# EasyEDA Pro project 32位四合一电调核心板.epro, board 100V_四路_控制板
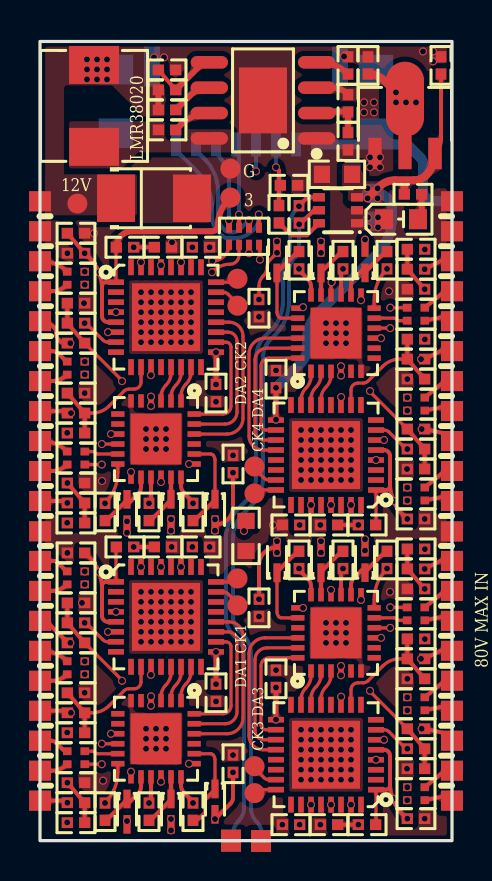
[diagram p1: board, top side]
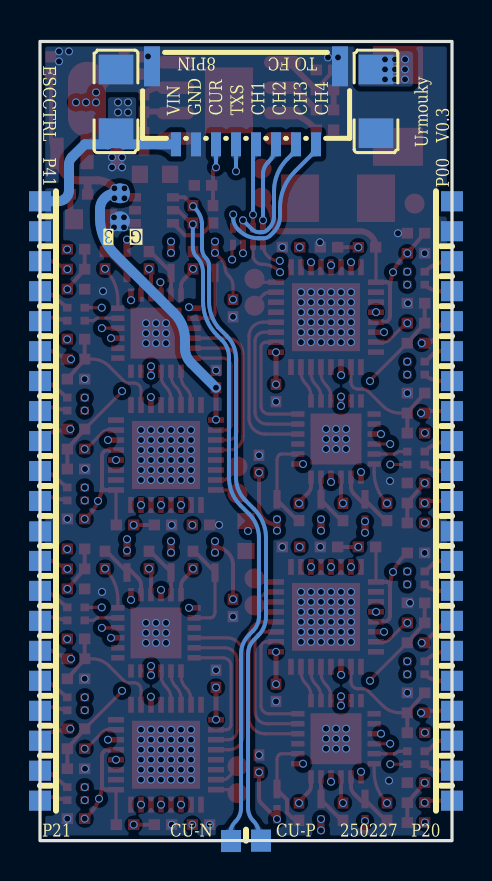
[diagram p2: board, bottom side, seen from below]

Outline 20.6 x 40 mm; copper layers: Top Layer, Inner1, Inner2, Bottom Layer. Coordinates in mm from the lower left corner of the outline.
Outline path: rectangle 0,40 20.6,0
Stack: Top Layer 0.035mm 外层铜厚1oz / Dielectric1 0.28mm 7628 RC49% 8.6mil / Inner1 0.035mm 内层铜厚 / Dielectric2 0.28mm 1.1mm H/HOZ 含铜 / Inner2 0.035mm 内层铜厚 / Dielectric3 0.28mm 7628 RC49% 8.6mil / Bottom Layer 0.035mm 外层铜厚1oz

## Design rules (mm)
template: 自定义配置
spacing copperThickness1oz (default): track to track 0.102, other pairs 0 to 0.3
spacing copperThickness2oz: track to track 0.203, other pairs 0.152 to 0.3
track width copperThickness1oz (default): min 0.127, default 0.254, max 2.54
track width copperThickness2oz: min 0.203, default 0.254, max 2.54
differential pair differentialPair (default): width min 0.127, default 0.254, max 2.54; gap min 0.152, default 0.152
via viaSize (default): diameter min 0.4, default 0.4, max 10; hole min 0.3, default 0.3, max 6.299

## Placement (name value [footprint] x y rotation side)
12V  -  [邮票孔1mm方]  0 32 0 top
C2  1nF  [R0402]  12.95 31.34 270 top
C4  100nF  [R0402]  9.65 3.85 270 top
C6  100nF  [R0402]  9.65 18.85 270 top
C7  100nF  [R0402]  20.05 38.8 90 top
C8  100nF  [R0402]  6.15 14.7 0 top
C9  100nF  [R0402]  6.15 29.7 0 top
C10  1uF  [R0402]  1.8 14.4 0 top
C11  100nF  [R0402]  8.8 7.4 90 top
C14  1uF  [R0402]  1.8 29.4 0 top
C15  100nF  [R0402]  8.8 22.4 90 top
C23  10uF  [R0603]  10.3 15.25 90 top
C24  1uF  [R0402]  16.4 38.8 270 top
C25  1uF  [R0402]  12.45 32.8 180 top
C26  1uF  [R0402]  1.8 30.4 180 top
C27  1uF  [R0402]  7.65 1.45 270 top
C28  1uF  [R0402]  5.45 1.45 270 top
C29  1uF  [R0402]  3.25 1.45 270 top
C30  1uF  [R0402]  7.65 16.45 270 top
C31  1uF  [R0402]  5.45 16.45 270 top
C32  1uF  [R0402]  3.25 16.45 270 top
C36  100nF  [R0402]  10.95 11.65 90 top
C38  100nF  [R0402]  10.95 26.65 90 top
C39  100nF  [R0402]  14.45 0.8 180 top
C40  100nF  [R0402]  14.45 15.8 180 top
C41  1uF  [R0402]  11.8 8.1 270 top
C42  100nF  [R0402]  18.8 1.1 180 top
C45  1uF  [R0402]  11.8 23.1 270 top
C46  100nF  [R0402]  18.8 16.1 180 top
C49  1uF  [R0402]  12.95 14.05 90 top
C50  1uF  [R0402]  15.15 14.05 90 top
C51  1uF  [R0402]  17.35 14.05 90 top
C52  1uF  [R0402]  12.95 29.05 90 top
C53  1uF  [R0402]  15.15 29.05 90 top
C54  1uF  [R0402]  17.35 29.05 90 top
C58  10uF  [R0603]  14.85 33.35 0 top
C61  100nF  [R0402]  6.35 35.57 0 top
C62  22uF  [C1206]  3.8 37 270 bottom
C63  4.7uF  [C1206]  16.8 37 90 bottom
C64  22uF  [CAP-SMD_L3.5-W2.8-R-RD]  5.7 32.15 180 top
CK1  -  [Test-Point-0.5mm]  9.87 13.12 0 top
CK2  -  [Test-Point-0.5mm]  9.87 28.12 0 top
CK3  -  [Test-Point-0.5mm]  10.73 2.38 180 top
CK3 DA3  -  [Test-Point-0.5mm]  10.73 3.73 180 top
CK4 DA4  -  [Test-Point-0.5mm]  10.73 17.38 180 top
CK5  -  [Test-Point-0.5mm]  1.87 31.88 0 top
CK6  -  [Test-Point-0.5mm]  9.52 32.18 0 top
CK7  -  [Test-Point-0.5mm]  9.52 33.63 0 top
CUR_N  -  [邮票孔1mm方]  11.05 -0.02 90 top
CUR_P  -  [邮票孔1mm方]  9.55 0 90 top
D3  1N4148WT  [SOD-523_L1.2-W0.8-LS1.6-RD]  8.75 1.95 270 top
D4  1N4148WT  [SOD-523_L1.2-W0.8-LS1.6-RD]  6.55 1.45 270 top
D5  1N4148WT  [SOD-523_L1.2-W0.8-LS1.6-RD]  4.35 1.45 270 top
D6  1N4148WT  [SOD-523_L1.2-W0.8-LS1.6-RD]  8.75 16.45 270 top
D7  1N4148WT  [SOD-523_L1.2-W0.8-LS1.6-RD]  6.55 16.45 270 top
D8  1N4148WT  [SOD-523_L1.2-W0.8-LS1.6-RD]  4.35 16.45 270 top
D11  1N4148WT  [SOD-523_L1.2-W0.8-LS1.6-RD]  11.85 14.05 90 top
D12  1N4148WT  [SOD-523_L1.2-W0.8-LS1.6-RD]  14.05 14.05 90 top
D13  1N4148WT  [SOD-523_L1.2-W0.8-LS1.6-RD]  16.25 14.05 90 top
D14  1N4148WT  [SOD-523_L1.2-W0.8-LS1.6-RD]  11.85 29.05 90 top
D15  1N4148WT  [SOD-523_L1.2-W0.8-LS1.6-RD]  14.05 29.05 90 top
D16  1N4148WT  [SOD-523_L1.2-W0.8-LS1.6-RD]  16.25 29.05 90 top
DA1 CK1  -  [Test-Point-0.5mm]  9.87 11.77 0 top
DA2 CK2  -  [Test-Point-0.5mm]  9.87 26.77 0 top
DA4  -  [Test-Point-0.5mm]  10.73 18.73 180 top
GND  -  [邮票孔1mm方]  0.01 15.48 0 top
GND1  -  [邮票孔1mm方]  0 30.5 0 top
GND2  -  [邮票孔1mm方]  20.59 15.48 0 top
L2  33uH  [IND-SMD_L5.4-W5.2]  2.7 36.77 270 top
MCU1  AT32F421K8U7  [QFN-32_L5.0-W5.0-P0.50-BL-EP3.4]  6.3 11.2 270 top
MCU2  AT32F421K8U7  [QFN-32_L5.0-W5.0-P0.50-BL-EP3.4]  6.3 26.2 270 top
MCU3  AT32F421K8U7  [QFN-32_L5.0-W5.0-P0.50-BL-EP3.4]  14.3 4.3 90 top
MCU4  AT32F421K8U7  [QFN-32_L5.0-W5.0-P0.50-BL-EP3.4]  14.3 19.3 90 top
MOSDRV1  FD6288Q  [QFN-24_L4.0-W4.0-P0.50-BL-EP2.6]  5.8 5.1 180 top
MOSDRV2  FD6288Q  [QFN-24_L4.0-W4.0-P0.50-BL-EP2.6]  5.8 20.1 180 top
MOSDRV3  FD6288Q  [QFN-24_L4.0-W4.0-P0.50-BL-EP2.6]  14.8 10.4 0 top
MOSDRV4  FD6288Q  [QFN-24_L4.0-W4.0-P0.50-BL-EP2.6]  14.8 25.4 0 top
PAD6  -  [邮票孔1mm方]  0 5 0 top
PAD7  -  [邮票孔1mm方]  0 20 0 top
PAD8  -  [邮票孔1mm方]  0 3.5 0 top
PAD9  -  [邮票孔1mm方]  0 18.5 0 top
PAD10  -  [邮票孔1mm方]  0 2 0 top
PAD11  -  [邮票孔1mm方]  0 17 0 top
PAD12  -  [邮票孔1mm方]  0 9.5 0 top
PAD13  -  [邮票孔1mm方]  0 24.5 0 top
PAD14  -  [邮票孔1mm方]  0 8 0 top
PAD15  -  [邮票孔1mm方]  0 23 0 top
PAD16  -  [邮票孔1mm方]  0 6.5 0 top
PAD17  -  [邮票孔1mm方]  0 21.5 0 top
PAD18  -  [邮票孔1mm方]  0 14 0 top
PAD19  -  [邮票孔1mm方]  0 29 0 top
PAD20  -  [邮票孔1mm方]  0 12.5 0 top
PAD21  -  [邮票孔1mm方]  0 27.5 0 top
PAD22  -  [邮票孔1mm方]  0 11 0 top
PAD23  -  [邮票孔1mm方]  0 26 0 top
PAD24  -  [邮票孔1mm方]  20.6 11 180 top
PAD25  -  [邮票孔1mm方]  20.6 26 180 top
PAD26  -  [邮票孔1mm方]  20.6 12.5 180 top
PAD27  -  [邮票孔1mm方]  20.6 27.5 180 top
PAD28  -  [邮票孔1mm方]  20.6 14 180 top
PAD29  -  [邮票孔1mm方]  20.6 29 180 top
PAD30  -  [邮票孔1mm方]  20.6 6.5 180 top
PAD31  -  [邮票孔1mm方]  20.6 21.5 180 top
PAD32  -  [邮票孔1mm方]  20.6 8 180 top
PAD33  -  [邮票孔1mm方]  20.6 23 180 top
PAD34  -  [邮票孔1mm方]  20.6 9.5 180 top
PAD35  -  [邮票孔1mm方]  20.6 24.5 180 top
PAD36  -  [邮票孔1mm方]  20.6 2 180 top
PAD37  -  [邮票孔1mm方]  20.6 17 180 top
PAD38  -  [邮票孔1mm方]  20.6 3.5 180 top
PAD39  -  [邮票孔1mm方]  20.6 18.5 180 top
PAD40  -  [邮票孔1mm方]  20.6 5 180 top
PAD41  -  [邮票孔1mm方]  20.6 20 180 top
PWR1  NCD0603G1  [LED0603-RD_1]  18.05 31.1 0 top
R1  10kΩ  [R0402]  8.05 14.7 0 top
R2  10kΩ  [R0402]  8.05 29.7 0 top
R3  56Ω  [R0402]  11.95 31.35 90 top
R4  10kΩ  [R0402]  4.25 14.7 180 top
R5  10kΩ  [R0402]  4.25 29.7 180 top
R6  100kΩ  [R0402]  6.35 37.57 180 top
R7  16.9kΩ  [R0402]  15.4 38.8 270 top
R8  10kΩ  [R0402]  1.8 0.9 0 top
R9  47kΩ  [R0402]  1.8 1.9 180 top
R10  10kΩ  [R0402]  1.8 15.9 0 top
R11  47kΩ  [R0402]  1.8 16.9 180 top
R12  10kΩ  [R0402]  1.8 5.4 0 top
R13  47kΩ  [R0402]  1.8 6.4 180 top
R14  10kΩ  [R0402]  1.8 20.4 0 top
R15  47kΩ  [R0402]  1.8 21.4 180 top
R16  10kΩ  [R0402]  1.8 10.9 180 top
R17  47kΩ  [R0402]  1.8 9.9 180 top
R18  10kΩ  [R0402]  1.8 25.9 180 top
R19  47kΩ  [R0402]  1.8 24.9 180 top
R20  4.7kΩ  [R0402]  18.65 32.35 0 top
R21  4.7kΩ  [R0402]  1.8 11.9 180 top
R22  4.7kΩ  [R0402]  1.8 7.4 180 top
R23  4.7kΩ  [R0402]  1.8 2.9 180 top
R24  4.7kΩ  [R0402]  1.8 26.9 180 top
R25  4.7kΩ  [R0402]  1.8 22.4 180 top
R26  4.7kΩ  [R0402]  1.8 17.9 180 top
R27  10kΩ  [R0402]  12.55 0.8 180 top
R28  10kΩ  [R0402]  12.55 15.8 180 top
R29  10kΩ  [R0402]  16.35 0.8 0 top
R30  10kΩ  [R0402]  16.35 15.8 0 top
R31  10kΩ  [R0402]  18.8 14.6 180 top
R32  47kΩ  [R0402]  18.8 13.6 0 top
R33  10kΩ  [R0402]  18.8 29.6 180 top
R34  47kΩ  [R0402]  18.8 28.6 0 top
R35  10kΩ  [R0402]  18.8 10.1 180 top
R36  47kΩ  [R0402]  18.8 9.1 0 top
R37  10kΩ  [R0402]  18.8 25.1 180 top
R38  47kΩ  [R0402]  18.8 24.1 0 top
R39  10kΩ  [R0402]  18.8 4.6 0 top
R40  47kΩ  [R0402]  18.8 5.6 0 top
R41  10kΩ  [R0402]  18.8 19.6 0 top
R42  47kΩ  [R0402]  18.8 20.6 0 top
R43  4.7kΩ  [R0402]  18.8 3.6 0 top
R44  4.7kΩ  [R0402]  18.8 8.1 0 top
R45  4.7kΩ  [R0402]  18.8 12.6 0 top
R46  4.7kΩ  [R0402]  18.8 18.6 0 top
R47  4.7kΩ  [R0402]  18.8 23.1 0 top
R48  4.7kΩ  [R0402]  18.8 27.6 0 top
R55  10kΩ  [R0402]  15.4 35 90 top
R56  47kΩ  [R0402]  15.4 36.9 270 top
R57  9.1kΩ  [R0402]  6.35 38.57 180 top
R58  100kΩ  [R0402]  6.35 36.57 0 top
RN1  10Ω  [RES-ARRAY-SMD_0402-4P-L1.0-W1.0-BL]  1.8 4.15 0 top
RN2  10Ω  [RES-ARRAY-SMD_0402-4P-L1.0-W1.0-BL]  1.8 19.15 0 top
RN3  10Ω  [RES-ARRAY-SMD_0402-4P-L1.0-W1.0-BL]  1.8 8.65 0 top
RN4  10Ω  [RES-ARRAY-SMD_0402-4P-L1.0-W1.0-BL]  1.8 23.65 0 top
RN5  10Ω  [RES-ARRAY-SMD_0402-4P-L1.0-W1.0-BL]  1.8 13.15 0 top
RN6  10Ω  [RES-ARRAY-SMD_0402-4P-L1.0-W1.0-BL]  1.8 28.15 0 top
RN7  47Ω  [RES-ARRAY-SMD_0402-8P-L2.0-W1.0-BL]  10.2 30.25 0 top
RN8  10Ω  [RES-ARRAY-SMD_0402-4P-L1.0-W1.0-BL]  18.8 11.35 180 top
RN9  10Ω  [RES-ARRAY-SMD_0402-4P-L1.0-W1.0-BL]  18.8 26.35 180 top
RN10  10Ω  [RES-ARRAY-SMD_0402-4P-L1.0-W1.0-BL]  18.8 6.85 180 top
RN11  10Ω  [RES-ARRAY-SMD_0402-4P-L1.0-W1.0-BL]  18.8 21.85 180 top
RN12  10Ω  [RES-ARRAY-SMD_0402-4P-L1.0-W1.0-BL]  18.8 2.35 180 top
RN13  10Ω  [RES-ARRAY-SMD_0402-4P-L1.0-W1.0-BL]  18.8 17.35 180 top
TP1  -  [Test-Point-0.5mm]  16.6 32.4 180 bottom
TP2  -  [Test-Point-0.5mm]  16.6 31 0 bottom
U1  INA199A1DCKR  [SC-70-6_L2.2-W1.3-P0.65-LS2.1-BR]  14.9 31.55 0 top
U2  LMR38020SDDAR  [ESOP-8_L4.9-W3.9-P1.27-LS6.0-BL-EP-1]  11.15 37.05 90 top
U4  HDGC1002WR-S-8P  [CONN-SMD_8P-P1.00_HDGC_HDGC1002WR-S-8P]  10.3 36.8 0 bottom
U5  ME6118A33PG  [SOT-89-3_L4.5-W2.5-P1.50-LS4.2-BR]  18.25 35.75 270 top
VIN  -  [邮票孔1mm方]  20.6 30.5 0 top
VIN1  -  [邮票孔1mm方]  20.6 32 0 top

## Footprints (pads in the part's own frame, mm; a bottom-side part is the same pattern mirrored in y, then rotated)
C1206
  rect 1.485x1.728 smd: 1(-1.593,0) 2(1.593,0)
CAP-SMD_L3.5-W2.8-R-RD
  rect 1.9x2.376 smd: 1(1.899,0) 2(-1.899,0)
CONN-SMD_8P-P1.00_HDGC_HDGC1002WR-S-8P
  rect 0.5x1.2 smd: 1(-3.5,1.95) 2(-2.5,1.95) 3(-1.5,1.95) 4(-0.5,1.95) 5(0.5,1.95) 6(1.5,1.95) 7(2.5,1.95) 8(3.5,1.95)
  rect 0.8x2 smd: 9(4.7,-1.95) 10(-4.7,-1.95)
ESOP-8_L4.9-W3.9-P1.27-LS6.0-BL-EP-1
  oval 0.63x1.865 smd: 1(-1.905,-2.683) 2(-0.635,-2.683) 3(0.635,-2.683) 4(1.905,-2.683) 5(1.905,2.683) 6(0.635,2.683) 7(-0.635,2.683) 8(-1.905,2.683)
  rect 3.3x2.4 smd: 9(0,0)
IND-SMD_L5.4-W5.2
  rect 1.9x2.5 smd: 1(2.05,0) 2(-2.05,0)
LED0603-RD_1
  rect 0.9x1 smd: 1(-0.85,0) 2(0.85,0)
QFN-24_L4.0-W4.0-P0.50-BL-EP2.6
  rect 0.28x0.665 smd: 1(-1.25,-1.907) 2(-0.75,-1.907) 3(-0.25,-1.907) 4(0.25,-1.907) 5(0.75,-1.907) 6(1.25,-1.907) 13(1.25,1.907) 14(0.75,1.907) 15(0.25,1.907) 16(-0.25,1.907) 17(-0.75,1.907) 18(-1.25,1.907)
  rect 0.665x0.28 smd: 7(1.907,-1.25) 8(1.907,-0.75) 9(1.907,-0.25) 10(1.907,0.25) 11(1.907,0.75) 12(1.907,1.25) 19(-1.907,1.25) 20(-1.907,0.75) 21(-1.907,0.25) 22(-1.907,-0.25) 23(-1.907,-0.75) 24(-1.907,-1.25)
  rect 2.55x2.55 smd: 25(0,0)
QFN-32_L5.0-W5.0-P0.50-BL-EP3.4
  rect 0.28x0.8 smd: 1(-1.75,-2.5) 2(-1.252,-2.5) 3(-0.751,-2.5) 4(-0.252,-2.5) 5(0.248,-2.5) 6(0.749,-2.5) 7(1.248,-2.5) 8(1.748,-2.5) 17(1.752,2.5) 18(1.252,2.5) 19(0.751,2.5) 20(0.252,2.5) 21(-0.248,2.5) 22(-0.749,2.5) 23(-1.248,2.5) 24(-1.748,2.5)
  rect 0.8x0.28 smd: 9(2.5,-1.748) 10(2.5,-1.248) 11(2.5,-0.748) 12(2.5,-0.248) 13(2.5,0.252) 14(2.5,0.752) 15(2.5,1.252) 16(2.5,1.752) 25(-2.5,1.75) 26(-2.5,1.25) 27(-2.5,0.75) 28(-2.5,0.25) 29(-2.5,-0.25) 30(-2.5,-0.75) 31(-2.5,-1.25) 32(-2.5,-1.75)
  rect 3.4x3.4 smd: 33(0,0)
R0402
  rect 0.566x0.54 smd: 1(-0.433,0) 2(0.433,0)
R0603
  rect 0.806x0.864 smd: 1(-0.753,0) 2(0.753,0)
RES-ARRAY-SMD_0402-4P-L1.0-W1.0-BL
  rect 0.425x0.39 smd: 1(-0.438,-0.325) 2(-0.438,0.325) 3(0.438,0.325) 4(0.438,-0.325)
RES-ARRAY-SMD_0402-8P-L2.0-W1.0-BL
  rect 0.3x0.505 smd: 1(-0.75,0.427) 2(-0.25,0.427) 3(0.25,0.427) 4(0.75,0.427) 5(0.75,-0.427) 6(0.25,-0.427) 7(-0.25,-0.427) 8(-0.75,-0.427)
SC-70-6_L2.2-W1.3-P0.65-LS2.1-BR
  rect 0.6x0.42 smd: 1(0.95,-0.65) 2(0.95,0) 3(0.95,0.65) 4(-0.95,0.65) 5(-0.95,0) 6(-0.95,-0.65)
SOD-523_L1.2-W0.8-LS1.6-RD
  rect 0.93x0.36 smd: 1(-0.635,0) 2(0.635,0)
SOT-89-3_L4.5-W2.5-P1.50-LS4.2-BR
  rect 1.575x0.672 smd: 1(1.356,-1.5) 3(1.356,1.5)
  custom 5.377x1.9 smd: 2(-1.356,0)
Test-Point-0.5mm
  round 1 smd: 1(0,0)
邮票孔1mm方
  custom 1.1x1 hole 0.8x0.6: 1(0,0)

## Nets
As in the schematic, except:
CH1_MCU_SWDIO: DA1 CK1.1 MCU1.23
CH2_MCU_SWDIO: DA2 CK2.1 MCU2.23
CH3_MCU_SWDIO: CK3 DA3.1 MCU3.23
CH4_MCU_SWCLK: CK4 DA4.1 MCU4.24

Pads without a net: MCU1 2 3 8 9 12 16 21 22 25 26 28 30 32; MCU2 2 3 8 9 12 16 21 22 25 26 28 30 32; MCU3 2 3 8 9 12 16 21 22 25 26 28 30 32; MCU4 2 3 8 9 12 16 21 22 25 26 28 30 32; MOSDRV1 5 7 8 21; MOSDRV2 5 7 8 21; MOSDRV3 5 7 8 21; MOSDRV4 5 7 8 21

## Via types
v1: diameter 0.4, hole 0.3, Top Layer to Bottom Layer, 425 vias

## Routing (per net, layer and track width the routed paths; a pad name or vN(x,y) marks a point on that pad's centre or on a via; arc(x,y) is an arc through that point)
3V3_MCU: length 140.1
  Top Layer w0.16: MCU1.1 3.8,14.66 arc(3.8,14.68) R4.2 ; MCU3.1 16.8,0.84 arc(16.8,0.82) R29.2 ; MCU4.1 16.8,15.84 arc(16.8,15.82) R30.2 ; MCU2.1 3.8,29.66 arc(3.8,29.68) R5.2
  Top Layer w0.2: 17.5,17.75 17.5,19.25 arc(17.41,19.46) 17.2,19.55 MCU4.5 ; 17.5,17.75 arc(17.56,17.36) 17.68,16.99 arc(17.92,16.57) 18.24,16.21 18.34,16.11 arc(18.36,16.1) v1(18.37,16.1) ; 17.5,17.75 arc(17.44,17.61) 17.3,17.55 MCU4.1 ; MCU1.5 3.4,10.95 arc(3.19,11.04) 3.1,11.25 3.1,12.75 ; C7.1 20.05,35.12 arc(19.97,34.73) U5.3 ; MCU3.1 17.3,2.55 arc(17.44,2.61) 17.5,2.75 ; MCU2.5 3.4,25.95 arc(3.19,26.04) 3.1,26.25 3.1,27.75 ; 3.1,27.75 arc(3.05,28.11) 2.94,28.45 arc(2.7,28.9) 2.36,29.29 2.25,29.39 arc(2.24,29.4) v1(2.23,29.4) C26.2 ; 3.1,27.75 arc(3.16,27.89) 3.3,27.95 MCU2.1 ; 3.1,12.75 arc(3.05,13.11) 2.94,13.45 arc(2.7,13.9) 2.36,14.29 2.25,14.39 arc(2.24,14.4) C10.2 ; 3.1,12.75 arc(3.16,12.89) 3.3,12.95 MCU1.1 ; 17.5,2.75 17.5,4.25 arc(17.41,4.46) 17.2,4.55 MCU3.5 ; 17.5,2.75 arc(17.54,2.42) 17.64,2.1 arc(17.89,1.62) 18.24,1.21 18.34,1.11 arc(18.36,1.1) v1(18.37,1.1)
  Top Layer w0.25: v1(8.8,22.83) MCU2.17 ; v1(8.8,7.83) v1(8.8,9.45) ; v1(11.8,22.67) MCU4.17 ; v1(11.8,7.67) MCU3.17
  Top Layer w0.3: CK6.1 9.44,32.1 arc(9.04,31.51) 8.9,30.8 arc(8.81,30.59) 8.6,30.5 8.45,30.5 ; 8.43,30.5 4.6,30.5 arc(4.05,30.27) 3.82,29.72 R5.2
  Top Layer w0.4: U5.3 19.75,34.39 arc(19.63,33.8) 19.3,33.3 arc(19.02,33.11) 18.7,33.05 17.75,33.05 arc(17.31,32.96) 16.94,32.72 v1(16.38,32.15) ; R20.1 18.22,32.92 arc(18.23,32.96) 18.25,33
  Inner1 w0.4: v1(11.8,22.67) v1(11.8,21.07) 11.8,17.93 arc(11.66,17.21) 11.25,16.6 10.96,16.31 arc(10.81,16.08) 10.75,15.8 10.75,15.58 arc(10.8,15.32) 10.95,15.1 arc(11.17,14.77) 11.25,14.38 11.25,14.32 arc(11.33,13.93) 11.55,13.6 arc(11.81,13.21) 11.9,12.76 11.9,11.27 arc(11.98,10.88) 12.2,10.55 arc(12.35,10.33) 12.4,10.07 12.4,7.74 ; v1(2.95,13.45) 2.95,15.33 arc(2.87,15.72) 2.65,16.05 arc(2.39,16.44) 2.3,16.9 2.3,20.53 arc(2.38,20.92) 2.6,21.25 arc(2.75,21.47) 2.8,21.73 2.8,26.65 2.95,26.8 v1(2.95,28.45) ; 12.4,7.74 12.4,7.51 arc(12.24,6.72) v1(11.8,6.06) ; 12.4,7.74 arc(12.32,7.69) 12.23,7.67 v1(11.8,7.67)
  Inner2 w0.3: v1(17.7,17) 16.65,17 arc(16.33,17.06) 16.05,17.25 arc(15.77,17.44) 15.45,17.5 13.29,17.5 arc(12.7,17.62) 12.2,17.95 arc(11.9,18.39) 11.8,18.92 v1(11.8,21.07) ; v1(11.8,6.06) 11.8,4.01 arc(11.93,3.35) 12.3,2.8 arc(12.69,2.54) 13.15,2.45 15.57,2.45 arc(15.83,2.4) 16.05,2.25 arc(16.22,2.14) 16.41,2.1 v1(17.65,2.1) ; v1(8.8,7.83) v1(8.8,9.45) 8.8,11.16 arc(8.62,12.07) 8.1,12.85 arc(7.82,13.04) 7.5,13.1 5.01,13.1 arc(4.82,13.14) 4.65,13.25 arc(4.43,13.4) 4.17,13.45 v1(2.95,13.45)
  Inner2 w0.4: v1(2.95,28.45) 4.26,28.45 arc(4.39,28.42) 4.5,28.35 4.59,28.26 arc(4.85,28.08) 5.15,28 ; 5.15,28 7.85,28 7.85,28 arc(8.52,27.72) 8.8,27.05 v1(8.8,24.44) v1(8.8,22.83) 11.63,22.83 arc(11.75,22.78) v1(11.8,22.67)
  Bottom Layer w0.5: TP1.1 16.8,32.4 arc(16.86,32.4) 16.91,32.39 arc(17.4,32.12) 17.6,31.6 17.6,31.15 arc(17.41,30.18) 16.86,29.36 13.9,26.4 arc(13.49,25.79) 13.35,25.07 13.35,24.65 arc(13.27,24.25) 13.04,23.91 v1(11.8,22.67)
  vias: v1(16.38,32.65) v1(16.88,32.65) v1(16.88,32.15)
12V_VGS: length 78.1
  Top Layer w0.16: v1(11.85,29.42) 11.51,29.08 arc(11.39,28.9) 11.35,28.7 arc(11.3,28.47) 11.17,28.27 11.15,28.25 arc(11,28.03) 10.95,27.77 v1(10.95,27.08)
  Top Layer w0.2: v1(9.65,3.42) 9.65,2.15 arc(9.62,1.99) 9.53,1.86 v1(8.75,1.08) ; v1(10.95,12.08) 10.95,13.79 arc(11.21,14.42) D11.2 ; v1(9.65,18.42) 9.65,16.72 arc(9.39,16.08) D6.2
  Top Layer w0.3: R6.2 R58.1
  Top Layer w0.4: v1(18.3,36.95) 17.8,37.45 17.22,38.03 arc(16.85,38.28) C24.2
  Inner1 w0.2: v1(11.85,29.98) v1(11.85,29.42)
  Inner2 w0.2: v1(8.75,1.08) 8.75,0.52
  Inner2 w0.4: v1(8.75,16.08) 10.63,16.08 arc(10.64,16.09) 10.65,16.1 ; v1(15.05,23.28) v1(15.05,23.74) 12.64,23.74 arc(12.61,23.73) 12.6,23.71 ; v1(9.65,3.42) 8.98,3.42 arc(8.57,3.59) 8.4,4 8.4,6.2 arc(8.24,6.59) 7.85,6.75 5.56,6.75 arc(5.55,6.75) v1(5.55,6.76) v1(5.55,7.22) ; v1(9.65,3.42) 10.07,3.42 arc(10.48,3.59) 10.65,4 10.65,4.19 arc(10.52,4.85) 10.15,5.4 arc(9.78,5.95) 9.65,6.61 9.65,11.59 arc(9.67,11.82) 9.71,12.05 arc(9.71,12.06) 9.72,12.07 ; v1(9.65,3.42) 9.49,3.26 arc(8.94,2.44) 8.75,1.47 v1(8.75,1.08) ; 10.65,14.98 10.65,14.01 arc(10.52,13.35) 10.15,12.8 arc(9.89,12.46) 9.72,12.07 ; 10.65,14.98 10.65,16.1 ; 10.65,14.98 arc(10.65,14.98) 10.65,14.98 v1(11.85,14.98) ; 12.6,23.71 12.6,26.01 arc(12.51,26.46) 12.25,26.85 arc(11.95,27.29) 11.85,27.82 v1(11.85,29.42) ; 12.6,23.71 12.6,22.61 arc(12.35,22) 11.74,21.75 11.3,21.75 arc(10.84,21.56) 10.65,21.1 10.65,18.44 ; v1(5.55,22.22) v1(5.55,21.76) arc(5.55,21.75) 5.56,21.75 7.85,21.75 arc(8.24,21.59) 8.4,21.2 8.4,19 arc(8.57,18.59) 8.98,18.42 v1(9.65,18.42) 10.63,18.42 arc(10.64,18.42) 10.65,18.44 ; 10.65,18.44 10.65,16.1 ; v1(15.05,8.28) v1(15.05,8.74) arc(15.05,8.75) 15.04,8.75 12.75,8.75 arc(12.36,8.91) 12.2,9.3 12.2,11.5 arc(12.03,11.91) 11.62,12.08 v1(10.95,12.08) 9.75,12.08 arc(9.73,12.08) 9.72,12.07
  vias: v1(2.35,39.1) v1(2.35,38.6) v1(2.35,38.1) v1(2.85,39.1) v1(2.85,38.6) v1(2.85,38.1) v1(3.35,39.1) v1(3.35,38.6) v1(3.35,38.1) v1(4.35,15.98) v1(4.35,15.42) v1(4.35,0.98) v1(6.55,16.08) v1(6.55,15.52) v1(6.55,1.08) v1(6.55,0.52) v1(8.75,15.52) v1(10.2,15.5) v1(11.85,14.42) v1(14.05,29.98) v1(14.05,29.42) v1(14.05,14.98) v1(14.05,14.42) v1(16.25,30.09) v1(16.25,15.09) v1(16.25,14.52) v1(17.8,37.45) v1(17.8,36.95) v1(18.8,36.95)
GND:
  vias: v1(1.37,29.4) v1(1.37,14.4) v1(2.1,11.9) v1(2.2,26.9) v1(2.23,22.4) v1(2.23,7.4) v1(2.7,30.4) v1(3.1,18) v1(3.15,3) v1(5.05,27.45) v1(5.05,26.95) v1(5.05,26.45) v1(5.05,25.95) v1(5.05,25.45) v1(5.05,24.95) v1(5.05,12.45) v1(5.05,11.95) v1(5.05,11.45) v1(5.05,10.95) v1(5.05,10.45) v1(5.05,9.95) v1(5.3,20.6) v1(5.3,20.1) v1(5.3,19.6) v1(5.3,5.6) v1(5.3,5.1) v1(5.3,4.6) v1(5.55,27.45) v1(5.55,26.95) v1(5.55,26.45) v1(5.55,25.95) v1(5.55,25.45) v1(5.55,24.95) v1(5.55,12.45) v1(5.55,11.95) v1(5.55,11.45) v1(5.55,10.95) v1(5.55,10.45) v1(5.55,9.95) v1(5.7,39.2) v1(5.8,20.6) v1(5.8,20.1) v1(5.8,19.6) v1(5.8,5.6) v1(5.8,5.1) v1(5.8,4.6) v1(6.05,27.45) v1(6.05,26.95) v1(6.05,26.45) v1(6.05,25.95) v1(6.05,25.45) v1(6.05,24.95) v1(6.05,12.45) v1(6.05,11.95) v1(6.05,11.45) v1(6.05,10.95) v1(6.05,10.45) v1(6.05,9.95) v1(6.2,39.2) v1(6.3,20.6) v1(6.3,20.1) v1(6.3,19.6) v1(6.3,5.6) v1(6.3,5.1) v1(6.3,4.6) v1(6.6,29.95) v1(6.55,27.45) v1(6.55,26.95) v1(6.55,26.45) v1(6.55,25.95) v1(6.55,25.45) v1(6.55,24.95) v1(6.58,14.7) v1(6.55,12.45) v1(6.55,11.95) v1(6.55,11.45) v1(6.55,10.95) v1(6.55,10.45) v1(6.55,9.95) v1(7.05,27.45) v1(7.05,26.95) v1(7.05,26.45) v1(7.05,25.95) v1(7.05,25.45) v1(7.05,24.95) v1(7.05,12.45) v1(7.05,11.95) v1(7.05,11.45) v1(7.05,10.95) v1(7.05,10.45) v1(7.05,9.95) v1(7.55,27.45) v1(7.55,26.95) v1(7.55,26.45) v1(7.55,25.95) v1(7.55,25.45) v1(7.55,24.95) v1(7.55,12.45) v1(7.55,11.95) v1(7.55,11.45) v1(7.55,10.95) v1(7.55,10.45) v1(7.55,9.95) v1(8.48,29.7) v1(8.48,14.7) v1(8.8,21.97) v1(8.8,6.97) v1(9.65,19.28) v1(9.65,4.28) v1(10.95,26.22) v1(10.95,11.22) v1(11.65,15.8) v1(11.8,23.53) v1(11.8,8.53) v1(12.12,0.8) v1(13.05,20.55) v1(13.05,20.05) v1(13.05,19.55) v1(13.05,19.05) v1(13.05,18.55) v1(13.05,18.05) v1(13.05,5.55) v1(13.05,5.05) v1(13.05,4.55) v1(13.05,4.05) v1(13.05,3.55) v1(13.05,3.05) v1(13.55,20.55) v1(13.55,20.05) v1(13.55,19.55) v1(13.55,19.05) v1(13.55,18.55) v1(13.55,18.05) v1(13.55,5.55) v1(13.55,5.05) v1(13.55,4.55) v1(13.55,4.05) v1(13.55,3.55) v1(13.55,3.05) v1(14.02,15.8) v1(14.02,0.8) v1(14.05,20.55) v1(14.05,20.05) v1(14.05,19.55) v1(14.05,19.05) v1(14.05,18.55) v1(14.05,18.05) v1(14.05,5.55) v1(14.05,5.05) v1(14.05,4.55) v1(14.05,4.05) v1(14.05,3.55) v1(14.05,3.05) v1(14.3,25.9) v1(14.3,25.4) v1(14.3,24.9) v1(14.3,10.9) v1(14.3,10.4) v1(14.3,9.9) v1(14.55,20.55) v1(14.55,20.05) v1(14.55,19.55) v1(14.55,19.05) v1(14.55,18.55) v1(14.55,18.05) v1(14.55,5.55) v1(14.55,5.05) v1(14.55,4.55) v1(14.55,4.05) v1(14.55,3.55) v1(14.55,3.05) v1(14.8,25.9) v1(14.8,25.4) v1(14.8,24.9) v1(14.8,10.9) v1(14.8,10.4) v1(14.8,9.9) v1(15.05,20.55) v1(15.05,20.05) v1(15.05,19.55) v1(15.05,19.05) v1(15.05,18.55) v1(15.05,18.05) v1(15.05,5.55) v1(15.05,5.05) v1(15.05,4.55) v1(15.05,4.05) v1(15.05,3.55) v1(15.05,3.05) v1(15.2,39.25) v1(15.3,25.9) v1(15.3,25.4) v1(15.3,24.9) v1(15.3,10.9) v1(15.3,10.4) v1(15.3,9.9) v1(15.55,20.55) v1(15.55,20.05) v1(15.55,19.55) v1(15.55,19.05) v1(15.55,18.55) v1(15.55,18.05) v1(15.55,5.55) v1(15.55,5.05) v1(15.55,4.55) v1(15.55,4.05) v1(15.55,3.55) v1(15.55,3.05) v1(16.4,31.2) v1(16.4,30.7) v1(16.5,34.2) v1(16.5,33.7) v1(16.9,31.2) v1(16.9,30.7) v1(17,34.2) v1(17,33.7) v1(17.45,27.5) v1(17.5,12.45) v1(18.37,23.1) v1(18.35,18.6) v1(18.37,8.1) v1(18.35,3.6) v1(19.15,39.5) v1(19.23,16.1) v1(19.23,1.1) v1(19.65,39.5) v1(19.65,39)
VIN_BOARD: length 11.1
  Top Layer w0.3: U2.3 14.61,37.69 arc(15.04,37.6) 15.4,37.36
  Bottom Layer w0.5: 16.81,35.24 16.8,35.25 C63.1 ; 16.81,35.24 17.2,34.85 18.36,34.85 19,34.2 arc(19.11,34.04) 19.15,33.85 19.15,32.55 arc(19.31,32.16) 19.7,32 VIN1.1 ; 16.81,35.24 16.42,34.85 U4.8
  vias: v1(16.2,36.95) v1(16.2,36.45) v1(16.7,36.95) v1(16.7,36.45)
CH1_CTRL_HU: length 8.7
  Top Layer w0.16: MOSDRV1.22 9.35,5.35 arc(9.92,5.58) 10.15,6.15 10.15,10.25 arc(9.94,10.74) 9.45,10.95 8.8,10.95
CH1_CTRL_HV: length 7.3
  Top Layer w0.16: 8.8,10.45 9.4,10.45 arc(9.72,10.32) 9.85,10 9.85,6.45 arc(9.67,6.03) 9.25,5.85 MOSDRV1.23
CH1_CTRL_HW: length 5.9
  Top Layer w0.16: MOSDRV1.24 9.15,6.35 arc(9.43,6.47) 9.55,6.75 9.55,9.7 arc(9.48,9.88) 9.3,9.95 MCU1.18
CH1_CTRL_LU: length 1.8
  Top Layer w0.16: 7.55,8.7 7.55,8.46 arc(7.49,8.13) 7.3,7.85 arc(7.11,7.57) 7.05,7.25 MOSDRV1.1
CH1_CTRL_LV: length 1.8
  Top Layer w0.16: 7.05,8.7 7.05,8.41 arc(6.99,8.08) 6.8,7.8 arc(6.61,7.52) 6.55,7.2 MOSDRV1.2
CH1_CTRL_LW: length 1.8
  Top Layer w0.16: MOSDRV1.3 6.05,7.2 arc(6.11,7.52) 6.3,7.8 arc(6.49,8.08) 6.55,8.41 6.55,8.7
CH1_MCU_SWCLK: length 1.1
  Top Layer w0.16: MCU1.24 9.45,12.95 arc(9.68,12.99) CK1.1
CH1_MCU_SWDIO: length 1.4
  Top Layer w0.16: MCU1.23 9.16,12.45 arc(9.29,12.42) 9.4,12.35 9.8,11.95 arc(9.86,11.87) DA1 CK1.1
CH1_MOS_BU: length 4.8
  Top Layer w0.16: MOSDRV1.20 8.53,4.35 arc(8.59,4.34) 8.65,4.3 arc(8.72,4.19) 8.75,4.06 D3.1
  Top Layer w0.2: C27.2 arc(7.85,1.06) 8.02,1.17 8.25,1.4 8.25,2.05 8.72,2.53 arc(8.74,2.55) D3.1
CH1_MOS_BV: length 2.7
  Top Layer w0.2: MOSDRV1.17 D4.1 arc(6.54,2.05) 6.53,2.03 5.56,1.06 arc(5.51,1.03) C28.2
CH1_MOS_BW: length 3
  Top Layer w0.2: MOSDRV1.14 5.05,2.7 arc(5.01,2.52) 4.91,2.36 4.5,1.95 ; C29.2 arc(3.31,1.03) 3.36,1.06 4.33,2.03 arc(4.34,2.05) D5.1
CH1_MOS_HU: length 5.8
  Top Layer w0.16: RN1.4 v1(3.09,3.83)
  Inner2 w0.16: v1(3.09,3.83) 3.65,3.26 arc(4,3.03) 4.4,2.95 arc(4.72,3.01) 5,3.2 5.5,3.7 arc(5.67,3.81) 5.86,3.85 v1(7.45,3.85)
CH1_MOS_HV: length 9.6
  Inner2 w0.16: v1(2.24,8.33) 2.56,8 arc(2.7,7.79) 2.75,7.55 2.75,5.85 2.65,5.75 2.65,2.9 arc(2.77,2.62) 3.05,2.5 5.7,2.5 arc(5.95,2.6) 6.05,2.85 v1(6.05,2.95)
CH1_MOS_HW: length 12
  Inner2 w0.16: v1(4.55,3.45) 4.55,4.44 arc(4.42,5.1) 4.05,5.65 arc(3.76,6.08) 3.66,6.59 3.66,9.18 arc(3.66,9.2) 3.66,9.22 arc(3.79,9.64) 4.05,10 arc(4.42,10.55) 4.55,11.21 4.55,12.45 arc(4.44,12.72) 4.18,12.83 v1(2.24,12.83)
CH1_MOS_LU: length 1.7
  Top Layer w0.16: MOSDRV1.11 2.91,4.35 arc(2.83,4.37) 2.76,4.41 arc(2.69,4.46) 2.61,4.48 RN1.3
CH1_MOS_LV: length 5.2
  Top Layer w0.16: MOSDRV1.10 v1(3.09,4.85)
  Inner2 w0.16: v1(2.24,8.98) 2.55,8.67 arc(2.95,8.06) 3.09,7.35 v1(3.09,4.85)
CH1_MOS_LW: length 10.8
  Inner2 w0.16: v1(2.24,13.48) 2.12,13.48 arc(1.86,13.37) 1.75,13.1 1.75,12.8 arc(1.88,12.48) 2.2,12.35 3.43,12.35 arc(3.82,12.27) 4.15,12.05 arc(4.25,11.9) 4.29,11.72 4.29,11.33 arc(4.16,10.69) 3.8,10.15 arc(3.5,9.71) 3.4,9.18 3.4,5.71 arc(3.44,5.52) v1(3.55,5.35)
CH1_OUT_U: length 9.7
  Top Layer w0.2: MOSDRV1.18 7.05,2.76 arc(7.09,2.57) 7.2,2.4 7.6,2 arc(7.64,1.94) v1(7.65,1.88) ; PAD10.1 1.27,2 arc(1.34,1.97) v1(1.37,1.9)
  Inner2 w0.16: v1(1.37,1.9) 1.68,1.9 arc(2.07,1.82) 2.4,1.6 2.64,1.36 arc(2.87,1.21) 3.15,1.15 3.54,1.15 arc(3.73,1.19) 3.9,1.3 3.91,1.31 arc(4.07,1.41) 4.25,1.45 5.45,1.45 arc(5.68,1.5) 5.88,1.63 5.9,1.65 arc(6.16,1.82) 6.46,1.88 v1(7.65,1.88)
CH1_OUT_V: length 10.8
  Top Layer w0.2: MOSDRV1.15 5.55,1.98 arc(5.52,1.91) v1(5.45,1.88) ; PAD16.1 1.13,6.5 arc(1.26,6.47) R13.2
  Inner2 w0.16: v1(1.55,6.4) 1.89,6.06 arc(2.04,5.83) 2.1,5.55 2.1,2.86 arc(2.2,2.34) 2.5,1.9 2.8,1.6 arc(2.97,1.49) 3.16,1.45 3.3,1.45 arc(3.53,1.5) 3.73,1.63 3.85,1.75 arc(4,1.85) 4.17,1.88 v1(5.45,1.88)
CH1_OUT_W: length 12.7
  Top Layer w0.16: MOSDRV1.12 3.89,3.43 arc(3.73,2.61) 3.26,1.9 arc(3.25,1.89) v1(3.25,1.88)
  Top Layer w0.2: PAD22.1 arc(0.28,10.94) 0.51,10.79 1.34,9.96 arc(1.36,9.93) R17.2
  Inner2 w0.16: v1(3.25,1.88) arc(3.03,1.93) 2.85,2.05 2.62,2.28 arc(2.45,2.54) 2.39,2.83 2.39,6.24 arc(2.37,6.31) 2.34,6.36 2,6.7 arc(1.81,6.98) 1.75,7.3 1.75,9.34 arc(1.69,9.64) v1(1.52,9.9)
CH1_SENS_U: length 12.6
  Top Layer w0.2: v1(1.37,2.9) R9.1 R8.2
  Inner2 w0.16: v1(1.37,2.9) 1.37,4.38 arc(1.4,4.55) 1.5,4.7 1.66,4.86 arc(1.76,5.02) 1.8,5.2 1.8,5.4 arc(1.67,5.72) 1.35,5.85 arc(1.15,5.93) 1.06,6.14 1.06,10.06 arc(1.18,10.34) 1.45,10.45 v1(3.4,10.45)
CH1_SENS_V: length 6.5
  Top Layer w0.16: R13.1 2.61,6.4 arc(3.06,6.49) 3.45,6.75 4.2,7.5 arc(4.31,7.57) 4.44,7.6 4.7,7.6 arc(4.95,7.7) 5.05,7.95 5.05,8.7
  Top Layer w0.2: R12.2 R13.1 R22.2
CH1_SENS_W: length 6.5
  Top Layer w0.16: R17.1 4.08,8.06 arc(4.09,8.03) v1(4.1,8)
  Top Layer w0.2: R17.1 R16.2 R21.2
  Inner2 w0.16: v1(4.1,8) 4.82,8 arc(5.21,8.08) v1(5.54,8.3)
CH1_SENS_ZERO: length 14.1
  Top Layer w0.16: MCU1.7 3.39,9.95 arc(3.26,9.98) 3.15,10.05 2.35,10.85 arc(2.29,10.89) v1(2.23,10.9)
  Inner2 w0.16: v1(2.23,10.9) 1.2,10.9 arc(0.92,10.78) 0.8,10.5 0.8,5.39 ; 0.8,5.39 0.8,1.47 arc(0.96,1.07) v1(1.36,0.91) ; 0.8,5.39 arc(0.81,5.4) 0.82,5.41 v1(1.36,5.41)
CH2_CTRL_HU: length 8.7
  Top Layer w0.16: 8.8,25.95 9.45,25.95 arc(9.94,25.74) 10.15,25.25 10.15,21.15 arc(9.92,20.58) 9.35,20.35 MOSDRV2.22
CH2_CTRL_HV: length 7.3
  Top Layer w0.16: 8.8,25.45 9.4,25.45 arc(9.72,25.32) 9.85,25 9.85,21.45 arc(9.67,21.03) 9.25,20.85 MOSDRV2.23
CH2_CTRL_HW: length 5.9
  Top Layer w0.16: MCU2.18 9.3,24.95 arc(9.48,24.88) 9.55,24.7 9.55,21.75 arc(9.43,21.47) 9.15,21.35 MOSDRV2.24
CH2_CTRL_LU: length 1.8
  Top Layer w0.16: 7.55,23.7 7.55,23.46 arc(7.49,23.13) 7.3,22.85 arc(7.12,22.57) 7.05,22.25 MOSDRV2.1
CH2_CTRL_LV: length 1.8
  Top Layer w0.16: MOSDRV2.2 6.55,22.2 arc(6.61,22.52) 6.8,22.8 arc(6.99,23.08) 7.05,23.41 7.05,23.7
CH2_CTRL_LW: length 1.8
  Top Layer w0.16: 6.55,23.7 6.55,23.41 arc(6.49,23.08) 6.3,22.8 arc(6.12,22.52) 6.05,22.2 MOSDRV2.3
CH2_MCU_SWCLK: length 1.1
  Top Layer w0.16: MCU2.24 9.45,27.95 arc(9.68,27.99) CK2.1
CH2_MCU_SWDIO: length 1.4
  Top Layer w0.16: MCU2.23 9.16,27.45 arc(9.29,27.42) 9.4,27.35 9.8,26.95 arc(9.86,26.87) DA2 CK2.1
CH2_MOS_BU: length 4.7
  Top Layer w0.16: MOSDRV2.20 8.53,19.35 arc(8.59,19.34) 8.65,19.3 arc(8.72,19.19) 8.75,19.06 D6.1
  Top Layer w0.2: D6.1 arc(8.74,17.05) 8.72,17.03 7.76,16.06 arc(7.71,16.03) C30.2
CH2_MOS_BV: length 2.7
  Top Layer w0.2: MOSDRV2.17 D7.1 arc(6.54,17.05) 6.53,17.03 5.56,16.06 arc(5.51,16.03) C31.2
CH2_MOS_BW: length 3
  Top Layer w0.2: MOSDRV2.14 5.05,17.7 arc(5.01,17.52) 4.91,17.36 4.5,16.95 ; C32.2 arc(3.31,16.03) 3.36,16.06 4.33,17.03 arc(4.34,17.05) D8.1
CH2_MOS_HU: length 5.8
  Top Layer w0.16: RN2.4 v1(3.09,18.83)
  Inner2 w0.16: v1(3.09,18.83) 3.65,18.26 arc(4,18.03) 4.4,17.95 arc(4.72,18.01) 5,18.2 5.5,18.7 arc(5.67,18.81) 5.86,18.85 v1(7.45,18.85)
CH2_MOS_HV: length 9.6
  Inner2 w0.16: v1(6.05,17.95) 6.05,17.85 arc(5.95,17.6) 5.7,17.5 3.05,17.5 arc(2.77,17.62) 2.65,17.9 2.65,20.75 2.75,20.85 2.75,22.55 arc(2.7,22.79) 2.56,23 v1(2.24,23.33)
CH2_MOS_HW: length 12
  Inner2 w0.16: v1(4.55,18.45) 4.55,19.44 arc(4.42,20.1) 4.05,20.65 arc(3.76,21.08) 3.66,21.59 3.66,24.18 arc(3.66,24.2) 3.66,24.22 arc(3.79,24.64) 4.05,25 arc(4.42,25.55) 4.55,26.21 4.55,27.45 arc(4.44,27.72) 4.18,27.83 v1(2.24,27.83)
CH2_MOS_LU: length 1.7
  Top Layer w0.16: RN2.3 2.61,19.48 arc(2.69,19.46) 2.76,19.41 arc(2.83,19.37) 2.91,19.35 MOSDRV2.11
CH2_MOS_LV: length 5.2
  Top Layer w0.16: MOSDRV2.10 v1(3.09,19.85)
  Inner2 w0.16: v1(2.24,23.98) 2.55,23.67 arc(2.95,23.06) 3.09,22.35 v1(3.09,19.85)
CH2_MOS_LW: length 10.8
  Inner2 w0.16: v1(2.24,28.48) 2.12,28.48 arc(1.86,28.37) 1.75,28.1 1.75,27.8 arc(1.88,27.48) 2.2,27.35 3.43,27.35 arc(3.82,27.27) 4.15,27.05 arc(4.25,26.9) 4.29,26.72 4.29,26.33 arc(4.16,25.69) 3.8,25.15 arc(3.5,24.71) 3.4,24.18 3.4,20.71 arc(3.44,20.52) v1(3.55,20.35)
CH2_OUT_U: length 9.6
  Top Layer w0.2: MOSDRV2.18 7.05,17.76 arc(7.09,17.57) 7.2,17.4 7.6,17 arc(7.64,16.94) v1(7.65,16.88) ; PAD11.1 1.13,17 arc(1.26,16.97) v1(1.37,16.9)
  Inner2 w0.16: v1(1.37,16.9) 1.68,16.9 arc(2.07,16.82) 2.4,16.6 2.64,16.36 arc(2.87,16.21) 3.15,16.15 3.54,16.15 arc(3.73,16.19) 3.9,16.3 3.91,16.31 arc(4.07,16.41) 4.25,16.45 5.45,16.45 arc(5.68,16.5) 5.88,16.63 5.9,16.65 arc(6.16,16.82) 6.46,16.88 v1(7.65,16.88)
CH2_OUT_V: length 10.8
  Top Layer w0.2: PAD17.1 1.13,21.5 arc(1.26,21.47) R15.2 ; MOSDRV2.15 5.55,16.98 arc(5.52,16.91) v1(5.45,16.88)
  Inner2 w0.16: v1(5.45,16.88) 4.17,16.88 arc(4,16.85) 3.85,16.75 3.73,16.63 arc(3.53,16.5) 3.3,16.45 3.16,16.45 arc(2.97,16.49) 2.8,16.6 2.5,16.9 arc(2.2,17.34) 2.1,17.86 2.1,20.55 arc(2.04,20.83) 1.89,21.06 v1(1.55,21.4)
CH2_OUT_W: length 12.8
  Top Layer w0.16: MOSDRV2.12 3.89,18.43 arc(3.73,17.61) 3.26,16.9 arc(3.25,16.89) v1(3.25,16.88)
  Top Layer w0.2: R19.2 1.24,24.9 arc(1.11,24.93) 1,25 0.94,25.06 arc(0.84,25.22) 0.8,25.4 0.8,25.46 arc(0.77,25.59) 0.7,25.7 0.68,25.72 arc(0.37,25.93) PAD23.1
  Inner2 w0.16: v1(3.25,16.88) arc(3.03,16.93) 2.85,17.05 2.62,17.28 arc(2.45,17.54) 2.39,17.83 2.39,21.24 arc(2.37,21.31) 2.34,21.36 2,21.7 arc(1.81,21.98) 1.75,22.3 1.75,24.34 arc(1.69,24.64) v1(1.52,24.9)
CH2_SENS_U: length 12.6
  Top Layer w0.2: R10.2 R11.1 v1(1.37,17.9)
  Inner2 w0.16: v1(3.4,25.45) 1.45,25.45 arc(1.18,25.34) 1.06,25.06 1.06,21.14 arc(1.15,20.93) 1.35,20.85 arc(1.67,20.72) 1.8,20.4 1.8,20.2 arc(1.76,20.02) 1.66,19.86 1.5,19.7 arc(1.4,19.55) 1.37,19.38 v1(1.37,17.9)
CH2_SENS_V: length 6.5
  Top Layer w0.16: 5.05,23.7 5.05,22.95 arc(4.95,22.7) 4.7,22.6 4.44,22.6 arc(4.31,22.57) 4.2,22.5 3.45,21.75 arc(3.06,21.49) 2.61,21.4 R15.1
  Top Layer w0.2: R14.2 R15.1 R25.2
CH2_SENS_W: length 6.5
  Top Layer w0.16: R19.1 4.08,23.06 arc(4.09,23.03) v1(4.1,23)
  Top Layer w0.2: R19.1 R18.2 R24.2
  Inner2 w0.16: v1(4.1,23) 4.82,23 arc(5.21,23.08) v1(5.54,23.3)
CH2_SENS_ZERO: length 14.1
  Top Layer w0.16: MCU2.7 3.39,24.95 arc(3.26,24.98) 3.15,25.05 2.35,25.85 arc(2.29,25.89) v1(2.23,25.9)
  Inner2 w0.16: 0.8,20.39 0.8,25.5 arc(0.92,25.78) 1.2,25.9 v1(2.23,25.9) ; 0.8,20.39 0.8,16.47 arc(0.96,16.07) v1(1.36,15.91) ; 0.8,20.39 arc(0.81,20.4) 0.82,20.41 v1(1.36,20.41)
CH3_CTRL_HU: length 8.7
  Top Layer w0.16: MOSDRV3.22 11.25,10.15 arc(10.68,9.92) 10.45,9.35 10.45,5.25 arc(10.66,4.76) 11.15,4.55 11.8,4.55
CH3_CTRL_HV: length 7.3
  Top Layer w0.16: MOSDRV3.23 11.35,9.65 arc(10.93,9.47) 10.75,9.05 10.75,5.5 arc(10.88,5.18) 11.2,5.05 11.8,5.05
CH3_CTRL_HW: length 5.9
  Top Layer w0.16: MCU3.18 11.3,5.55 arc(11.12,5.62) 11.05,5.8 11.05,8.75 arc(11.17,9.03) 11.45,9.15 MOSDRV3.24
CH3_CTRL_LU: length 1.8
  Top Layer w0.16: MCU3.15 13.05,7.04 arc(13.11,7.37) 13.3,7.65 arc(13.49,7.93) 13.55,8.25 MOSDRV3.1
CH3_CTRL_LV: length 1.8
  Top Layer w0.16: MCU3.14 13.55,7.09 arc(13.61,7.42) 13.8,7.7 arc(13.99,7.98) 14.05,8.3 MOSDRV3.2
CH3_CTRL_LW: length 1.8
  Top Layer w0.16: MOSDRV3.3 14.55,8.3 arc(14.49,7.98) 14.3,7.7 arc(14.11,7.42) 14.05,7.09 MCU3.13
CH3_MCU_SWCLK: length 1.1
  Top Layer w0.16: MCU3.24 11.15,2.55 arc(10.92,2.51) CK3.1
CH3_MCU_SWDIO: length 1.4
  Top Layer w0.16: MCU3.23 11.44,3.05 arc(11.31,3.08) 11.2,3.15 10.8,3.55 arc(10.74,3.63) CK3 DA3.1
CH3_MOS_BU: length 4.7
  Top Layer w0.16: MOSDRV3.20 12.07,11.15 arc(12.01,11.16) 11.95,11.2 arc(11.88,11.31) 11.85,11.44 D11.1
  Top Layer w0.2: C49.2 arc(12.89,14.47) 12.84,14.44 11.87,13.48 arc(11.86,13.45) D11.1
CH3_MOS_BV: length 2.7
  Top Layer w0.2: MOSDRV3.17 D12.1 arc(14.06,13.45) 14.07,13.48 15.03,14.44 arc(15.09,14.47) C50.2
CH3_MOS_BW: length 3
  Top Layer w0.2: MOSDRV3.14 15.55,12.8 arc(15.59,12.98) 15.69,13.14 16.1,13.55 ; D13.1 arc(16.26,13.45) 16.27,13.48 17.24,14.44 arc(17.29,14.47) C51.2
CH3_MOS_HU: length 5.8
  Top Layer w0.16: RN8.4 v1(17.51,11.68)
  Inner2 w0.16: v1(13.15,11.65) 14.74,11.65 arc(14.93,11.69) 15.1,11.8 15.6,12.3 arc(15.88,12.49) 16.2,12.55 arc(16.6,12.47) 16.95,12.24 v1(17.51,11.68)
CH3_MOS_HV: length 9.6
  Inner2 w0.16: v1(14.55,12.55) 14.55,12.65 arc(14.65,12.9) 14.9,13 17.55,13 arc(17.83,12.88) 17.95,12.6 17.95,9.75 17.85,9.65 17.85,7.95 arc(17.9,7.71) 18.04,7.5 v1(18.36,7.18)
CH3_MOS_HW: length 12
  Inner2 w0.16: v1(16.05,12.05) 16.05,11.06 arc(16.18,10.4) 16.55,9.85 arc(16.84,9.42) 16.94,8.91 16.94,6.32 arc(16.94,6.3) 16.94,6.28 arc(16.81,5.86) 16.55,5.5 arc(16.18,4.95) 16.05,4.29 16.05,3.05 arc(16.16,2.78) 16.43,2.68 v1(18.36,2.68)
CH3_MOS_LU: length 1.7
  Top Layer w0.16: RN8.3 17.99,11.03 arc(17.91,11.04) 17.84,11.09 arc(17.77,11.13) 17.69,11.15 MOSDRV3.11
CH3_MOS_LV: length 5.2
  Top Layer w0.16: MOSDRV3.10 v1(17.51,10.65)
  Inner2 w0.16: v1(18.36,6.53) 18.05,6.83 arc(17.65,7.44) 17.51,8.15 v1(17.51,10.65)
CH3_MOS_LW: length 10.8
  Inner2 w0.16: v1(18.36,2.03) 18.47,2.03 arc(18.74,2.13) 18.85,2.4 18.85,2.7 arc(18.72,3.02) 18.4,3.15 17.17,3.15 arc(16.78,3.23) 16.45,3.45 arc(16.35,3.6) 16.31,3.78 16.31,4.17 arc(16.44,4.81) 16.8,5.35 arc(17.1,5.79) 17.2,6.32 17.2,9.79 arc(17.16,9.98) v1(17.05,10.15)
CH3_OUT_U: length 9.8
  Top Layer w0.2: v1(19.23,13.6) 20.6,14.3 ; MOSDRV3.18 13.55,12.74 arc(13.51,12.93) 13.4,13.1 13,13.5 arc(12.96,13.56) v1(12.95,13.62)
  Inner2 w0.16: v1(19.23,13.6) 18.92,13.6 arc(18.53,13.68) 18.2,13.9 17.96,14.14 arc(17.73,14.29) 17.45,14.35 17.06,14.35 arc(16.87,14.31) 16.7,14.2 16.69,14.19 arc(16.53,14.09) 16.35,14.05 15.15,14.05 arc(14.92,14) 14.72,13.87 14.7,13.85 arc(14.44,13.68) 14.14,13.62 v1(12.95,13.62)
CH3_OUT_V: length 11
  Top Layer w0.2: MOSDRV3.15 15.05,13.52 arc(15.08,13.59) v1(15.15,13.62) ; R36.2 20.6,9.8
  Inner2 w0.16: v1(19.05,9.1) 18.71,9.44 arc(18.56,9.67) 18.5,9.95 18.5,12.64 arc(18.4,13.16) 18.1,13.6 17.8,13.9 arc(17.63,14.01) 17.44,14.05 17.3,14.05 arc(17.07,14) 16.87,13.87 16.75,13.75 arc(16.6,13.65) 16.43,13.62 v1(15.15,13.62)
CH3_OUT_W: length 12.3
  Top Layer w0.16: MOSDRV3.12 16.71,12.07 arc(16.87,12.89) 17.34,13.59 arc(17.35,13.61) v1(17.35,13.62)
  Top Layer w0.2: R40.2 20.6,5.3
  Inner2 w0.16: v1(17.35,13.62) arc(17.57,13.57) 17.75,13.45 17.98,13.22 arc(18.15,12.96) 18.21,12.67 18.21,9.26 arc(18.23,9.19) 18.26,9.14 18.6,8.8 arc(18.79,8.52) 18.85,8.2 18.85,6.16 arc(18.91,5.86) v1(19.08,5.6)
CH3_SENS_U: length 12.6
  Top Layer w0.2: v1(19.23,12.6) R32.1 R31.2
  Inner2 w0.16: v1(17.2,5.05) 19.15,5.05 arc(19.42,5.16) 19.54,5.44 19.54,9.36 arc(19.45,9.57) 19.25,9.65 arc(18.93,9.78) 18.8,10.1 18.8,10.3 arc(18.84,10.48) 18.94,10.64 19.1,10.8 arc(19.2,10.95) 19.23,11.12 v1(19.23,12.6)
CH3_SENS_V: length 6.5
  Top Layer w0.16: MCU3.10 15.55,7.55 arc(15.65,7.8) 15.9,7.9 16.16,7.9 arc(16.29,7.93) 16.4,8 17.15,8.75 arc(17.54,9.01) 18,9.1 R36.1
  Top Layer w0.2: R44.2 R36.1 R35.2
CH3_SENS_W: length 6.5
  Top Layer w0.16: R40.1 16.52,7.44 arc(16.51,7.47) v1(16.5,7.5)
  Top Layer w0.2: R43.2 R39.2 R40.1
  Inner2 w0.16: v1(16.5,7.5) 15.78,7.5 arc(15.39,7.42) v1(15.06,7.2)
CH3_SENS_ZERO: length 14.1
  Top Layer w0.16: MCU3.7 17.21,5.55 arc(17.34,5.52) 17.45,5.45 18.25,4.65 arc(18.31,4.61) v1(18.37,4.6)
  Inner2 w0.16: v1(19.24,10.09) 19.78,10.09 arc(19.79,10.1) 19.8,10.11 ; 19.8,10.11 19.8,5 arc(19.68,4.72) 19.4,4.6 v1(18.37,4.6) ; 19.8,10.11 19.8,14.03 arc(19.64,14.43) v1(19.24,14.59)
CH4_CTRL_HU: length 8.7
  Top Layer w0.16: MOSDRV4.22 11.25,25.15 arc(10.68,24.92) 10.45,24.35 10.45,20.25 arc(10.66,19.76) 11.15,19.55 11.8,19.55
CH4_CTRL_HV: length 7.3
  Top Layer w0.16: 11.8,20.05 11.2,20.05 arc(10.88,20.18) 10.75,20.5 10.75,24.05 arc(10.93,24.47) 11.35,24.65 MOSDRV4.23
CH4_CTRL_HW: length 5.9
  Top Layer w0.16: MCU4.18 11.3,20.55 arc(11.12,20.62) 11.05,20.8 11.05,23.75 arc(11.17,24.03) 11.45,24.15 MOSDRV4.24
CH4_CTRL_LU: length 1.8
  Top Layer w0.16: MOSDRV4.1 13.55,23.25 arc(13.49,22.93) 13.3,22.65 arc(13.11,22.37) 13.05,22.04 MCU4.15
CH4_CTRL_LV: length 1.8
  Top Layer w0.16: MOSDRV4.2 14.05,23.3 arc(13.99,22.98) 13.8,22.7 arc(13.61,22.42) 13.55,22.09 MCU4.14
CH4_CTRL_LW: length 1.8
  Top Layer w0.16: MCU4.13 14.05,22.09 arc(14.11,22.42) 14.3,22.7 arc(14.49,22.98) 14.55,23.3 MOSDRV4.3
CH4_MCU_SWCLK: length 1.1
  Top Layer w0.16: MCU4.24 11.15,17.55 arc(10.92,17.51) CK4 DA4.1
CH4_MCU_SWDIO: length 1.4
  Top Layer w0.16: MCU4.23 11.44,18.05 arc(11.31,18.08) 11.2,18.15 10.8,18.55 arc(10.74,18.63) DA4.1
CH4_MOS_BU: length 4.7
  Top Layer w0.16: MOSDRV4.20 12.07,26.15 arc(12.01,26.16) 11.95,26.2 arc(11.88,26.31) 11.85,26.44 D14.1
  Top Layer w0.2: C52.2 arc(12.89,29.47) 12.84,29.44 11.88,28.47 arc(11.86,28.45) D14.1
CH4_MOS_BV: length 2.7
  Top Layer w0.2: MOSDRV4.17 D15.1 arc(14.06,28.45) 14.08,28.48 15.03,29.44 arc(15.09,29.47) C53.2
CH4_MOS_BW: length 3
  Top Layer w0.2: MOSDRV4.14 15.55,27.8 arc(15.59,27.98) 15.69,28.14 16.1,28.55 ; C54.2 arc(17.29,29.47) 17.24,29.44 16.28,28.48 arc(16.26,28.45) D16.1
CH4_MOS_HU: length 5.8
  Top Layer w0.16: RN9.4 v1(17.51,26.68)
  Inner2 w0.16: v1(17.51,26.68) 16.95,27.24 arc(16.6,27.47) 16.2,27.55 arc(15.88,27.49) 15.6,27.3 15.22,26.92 arc(14.98,26.76) 14.69,26.7 v1(13.15,26.7)
CH4_MOS_HV: length 9.9
  Top Layer w0.16: MOSDRV4.16 14.55,27.82 arc(14.54,27.89) v1(14.58,27.95)
  Inner2 w0.16: v1(18.36,22.18) 18.04,22.5 arc(17.9,22.71) 17.85,22.95 17.85,24.65 17.95,24.75 17.95,27.6 arc(17.83,27.88) 17.55,28 14.82,28 arc(14.7,28) v1(14.58,27.95)
CH4_MOS_HW: length 12
  Inner2 w0.16: v1(16.05,27.05) 16.05,26.06 arc(16.18,25.4) 16.55,24.85 arc(16.84,24.42) 16.94,23.91 16.94,21.32 arc(16.94,21.3) 16.94,21.28 arc(16.81,20.86) 16.55,20.5 arc(16.18,19.95) 16.05,19.29 16.05,18.05 arc(16.16,17.78) 16.43,17.68 v1(18.36,17.68)
CH4_MOS_LU: length 1.7
  Top Layer w0.16: RN9.3 17.99,26.03 arc(17.91,26.04) 17.84,26.09 arc(17.77,26.13) 17.69,26.15 MOSDRV4.11
CH4_MOS_LV: length 5.2
  Top Layer w0.16: MOSDRV4.10 v1(17.51,25.65)
  Inner2 w0.16: v1(18.36,21.53) 18.05,21.83 arc(17.65,22.44) 17.51,23.15 v1(17.51,25.65)
CH4_MOS_LW: length 10.8
  Inner2 w0.16: v1(18.36,17.03) 18.47,17.03 arc(18.74,17.13) 18.85,17.4 18.85,17.7 arc(18.72,18.02) 18.4,18.15 17.17,18.15 arc(16.78,18.23) 16.45,18.45 arc(16.35,18.6) 16.31,18.78 16.31,19.17 arc(16.44,19.81) 16.8,20.35 arc(17.1,20.79) 17.2,21.32 17.2,24.79 arc(17.16,24.98) v1(17.05,25.15)
CH4_OUT_U: length 9.8
  Top Layer w0.2: v1(19.23,28.6) 20.6,29.3 ; MOSDRV4.18 13.55,27.74 arc(13.51,27.93) 13.4,28.1 13,28.5 arc(12.96,28.56) v1(12.95,28.62)
  Inner2 w0.16: v1(12.95,28.62) 14.14,28.62 arc(14.44,28.68) 14.7,28.85 14.72,28.87 arc(14.92,29) 15.15,29.05 16.35,29.05 arc(16.53,29.09) 16.69,29.19 16.7,29.2 arc(16.87,29.31) 17.06,29.35 17.45,29.35 arc(17.73,29.29) 17.96,29.14 18.2,28.9 arc(18.53,28.68) 18.92,28.6 v1(19.23,28.6)
CH4_OUT_V: length 11
  Top Layer w0.2: MOSDRV4.15 15.05,28.52 arc(15.08,28.59) v1(15.15,28.62) ; R38.2 20.6,24.8
  Inner2 w0.16: v1(19.05,24.1) 18.71,24.44 arc(18.56,24.67) 18.5,24.95 18.5,27.64 arc(18.4,28.16) 18.1,28.6 17.8,28.9 arc(17.63,29.01) 17.44,29.05 17.3,29.05 arc(17.07,29) 16.87,28.87 16.75,28.75 arc(16.6,28.65) 16.43,28.62 v1(15.15,28.62)
CH4_OUT_W: length 12.3
  Top Layer w0.16: MOSDRV4.12 16.71,27.07 arc(16.87,27.89) 17.34,28.59 arc(17.35,28.61) v1(17.35,28.62)
  Top Layer w0.2: R42.2 20.6,20.3
  Inner2 w0.16: v1(17.35,28.62) arc(17.57,28.57) 17.75,28.45 17.98,28.22 arc(18.15,27.96) 18.21,27.67 18.21,24.26 arc(18.23,24.19) 18.26,24.14 18.6,23.8 arc(18.79,23.52) 18.85,23.2 18.85,21.16 arc(18.91,20.86) v1(19.08,20.6)
CH4_SENS_U: length 12.6
  Top Layer w0.2: v1(19.23,27.6) R34.1 R33.2
  Inner2 w0.16: v1(19.23,27.6) 19.23,26.12 arc(19.2,25.95) 19.1,25.8 18.94,25.64 arc(18.84,25.48) 18.8,25.3 18.8,25.1 arc(18.93,24.78) 19.25,24.65 arc(19.45,24.57) 19.54,24.36 19.54,20.44 arc(19.42,20.16) 19.15,20.05 v1(17.2,20.05)
CH4_SENS_V: length 6.5
  Top Layer w0.16: R38.1 18,24.1 arc(17.54,24.01) 17.15,23.75 16.4,23 arc(16.29,22.93) 16.16,22.9 15.9,22.9 arc(15.65,22.8) 15.55,22.55 MCU4.10
  Top Layer w0.2: R37.2 R38.1 R47.2
CH4_SENS_W: length 6.5
  Top Layer w0.16: R42.1 16.52,22.44 arc(16.51,22.47) v1(16.5,22.5)
  Top Layer w0.2: R42.1 R41.2 R46.2
  Inner2 w0.16: v1(16.5,22.5) 15.78,22.5 arc(15.39,22.42) v1(15.06,22.2)
CH4_SENS_ZERO: length 14.1
  Top Layer w0.16: MCU4.7 17.21,20.55 arc(17.34,20.52) 17.45,20.45 18.25,19.65 arc(18.31,19.61) v1(18.37,19.6)
  Inner2 w0.16: v1(19.24,25.09) 19.78,25.09 arc(19.79,25.1) 19.8,25.11 ; 19.8,25.11 19.8,29.03 arc(19.64,29.43) v1(19.24,29.59) ; 19.8,25.11 19.8,20 arc(19.68,19.72) 19.4,19.6 v1(18.37,19.6)
CUR_N: length 33.6
  Top Layer w0.2: U1.5 13.7,31.55 13.06,30.91 C2.2 12.96,30.9 v1(12.96,30.85)
  Bottom Layer w0.2: v1(12.96,30.85) 12.96,29.66 12.95,29.65 arc(12.9,29.42) 12.77,29.22 arc(12.53,28.87) 12.45,28.45 12.45,26.99 arc(12.27,26.08) 11.75,25.3 11.5,25.05 arc(11.24,24.66) 11.15,24.2 11.15,18.17 arc(11,17.42) 10.58,16.78 10.15,16.35 arc(9.78,15.8) 9.65,15.15 9.65,11.22 arc(9.73,10.83) 9.95,10.5 10.15,10.3 arc(10.45,9.85) 10.55,9.33 10.55,1.62 arc(10.62,1.26) 10.83,0.95 arc(11.03,0.65) 11.1,0.29 11.1,-0.02
CUR_P: length 34.4
  Top Layer w0.2: v1(12.95,31.75) C2.1 13.37,32.2 13.85,32.2
  Bottom Layer w0.2: 9.65,0 9.65,0.31 arc(9.72,0.67) 9.92,0.97 arc(10.13,1.28) 10.2,1.64 10.2,9.33 arc(10.12,9.72) 9.9,10.05 9.7,10.25 arc(9.4,10.69) 9.3,11.22 9.3,15.15 arc(9.46,15.94) 9.9,16.6 10.33,17.03 arc(10.68,17.55) 10.8,18.17 10.8,24.14 arc(10.92,24.75) 11.26,25.26 11.71,25.71 arc(12.04,26.31) 12.15,26.99 12.15,28.78 arc(12.19,28.98) 12.3,29.15 arc(12.45,29.37) 12.5,29.63 12.5,30.81 arc(12.5,30.88) 12.51,30.94 arc(12.62,31.32) 12.85,31.65 v1(12.95,31.75)
PWM_CH1_BOARD: length 18
  Top Layer w0.16: RN7.7 9.95,29.3 arc(9.82,28.98) 9.5,28.85 arc(9.04,28.76) 8.65,28.5 v1(8.6,28.45)
  Inner1 w0.16: v1(7.05,13.7) 7.05,14.6 arc(7.14,15.06) 7.4,15.45 8.39,16.44 arc(8.73,16.95) 8.85,17.55 8.85,19.86 arc(8.94,20.31) 9.2,20.7 arc(9.39,20.98) 9.45,21.3 9.45,25.66 arc(9.36,26.11) 9.1,26.5 arc(8.73,27.05) 8.6,27.71 v1(8.6,28.45)
PWM_CH1_PORT: length 4.2
  Top Layer w0.2: RN7.2 v1(9.95,31.33)
  Bottom Layer w0.2: v1(9.95,31.33) 9.95,34.49 arc(9.91,34.68) U4.4
PWM_CH2_BOARD: length 2.9
  Top Layer w0.16: v1(8.61,29.02) 8.65,29.02 arc(9.21,29.25) RN7.8
  Inner2 w0.2: v1(7.05,28.95) 8.44,28.95 arc(8.53,28.97) v1(8.61,29.02)
PWM_CH2_PORT: length 4.4
  Top Layer w0.16: v1(9.45,31.05) RN7.1
  Bottom Layer w0.2: v1(9.45,31.05) 9.45,33.35 arc(9.39,33.67) 9.2,33.95 9.15,34 arc(8.89,34.39) U4.3
PWM_CH3_BOARD: length 29.2
  Top Layer w0.16: RN7.6 v1(10.45,29.4)
  Inner1 w0.16: v1(10.45,29.4) 10.45,29.13 arc(10.59,28.41) 11,27.8 11.61,27.19 arc(12.16,26.37) 12.35,25.4 12.35,11.77 arc(12.43,11.38) 12.65,11.05 arc(12.84,10.77) 12.9,10.45 12.9,6.93 arc(12.85,6.67) 12.7,6.45 arc(12.55,6.23) 12.5,5.97 12.5,3.55 arc(12.63,2.9) 13,2.36 v1(13.55,1.8)
PWM_CH3_PORT: length 6.2
  Bottom Layer w0.2: v1(10.45,31.05) 10,30.6 arc(9.83,30.49) 9.64,30.45 9.5,30.45 arc(9.36,30.48) 9.24,30.56 9.15,30.65 arc(8.96,30.93) 8.9,31.25 8.9,32.5 arc(8.73,33.38) 8.23,34.12 8.01,34.34 arc(7.86,34.57) U4.2
PWM_CH4_BOARD: length 13.9
  Top Layer w0.16: v1(11,29.08) 11,29.71 arc(10.98,29.77) RN7.5
  Inner1 w0.16: v1(11,29.08) 11,28.96 arc(11.13,28.31) 11.5,27.75 11.93,27.32 arc(12.44,26.57) 12.61,25.68 12.61,18.04 arc(12.67,17.76) 12.83,17.53 v1(13.55,16.8)
PWM_CH4_PORT: length 8.6
  Top Layer w0.2: v1(10.94,31.34) RN7.4
  Bottom Layer w0.2: v1(10.94,31.34) 10.94,31.18 arc(10.88,30.87) 10.7,30.6 10.64,30.54 arc(10.21,30.25) 9.7,30.15 ; U4.1 arc(6.86,34.57) 7.01,34.34 7.85,33.5 arc(8.41,32.67) 8.6,31.7 8.6,31.22 arc(8.69,30.8) 8.94,30.44 9.08,30.29 arc(9.24,30.19) 9.43,30.15 9.64,30.15 arc(9.67,30.15) 9.7,30.15
SENS_CUR: length 3.1
  Top Layer w0.2: v1(11.8,33.7) 11.95,33.55 R3.2
  Bottom Layer w0.2: U4.6 v1(11.8,33.7)
TXS: length 62.1
  Inner1 w0.16: v1(14.55,16.8) 14.55,16.55 arc(14.74,15.58) 15.29,14.76 15.74,14.31 arc(15.82,14.19) 15.85,14.05 15.85,13.69 arc(15.82,13.56) 15.75,13.45 arc(15.64,13.28) 15.6,13.09 15.6,12.07 arc(15.68,11.68) 15.9,11.35 arc(16.05,11.13) 16.1,10.87 16.1,9.45 arc(16.04,9.13) 15.85,8.85 arc(15.74,8.68) 15.7,8.49 15.7,6.98 arc(15.75,6.72) 15.9,6.5 15.96,6.44 arc(16.06,6.28) 16.1,6.1 16.1,3.01 arc(16.06,2.82) 15.95,2.65 15.93,2.63 arc(15.62,2.42) 15.25,2.35 arc(15.11,2.32) 14.99,2.24 v1(14.55,1.8) arc(14.53,1.71) 14.48,1.63 14.33,1.48 arc(14.13,1.35) 13.9,1.3 13.71,1.3 arc(13.05,1.43) 12.5,1.8 11.99,2.31 arc(11.44,3.13) 11.25,4.1 11.25,8.7 arc(11.06,9.67) 10.51,10.49 8.15,12.85 arc(7.93,13) 7.67,13.05 6.49,13.05 arc(6.36,13.08) 6.25,13.15 6.12,13.28 arc(6.07,13.36) 6.05,13.45 v1(6.05,13.7) 6.05,16.2 arc(6.11,16.52) 6.3,16.8 6.41,16.91 arc(6.57,17.01) 6.75,17.05 arc(7.17,17.13) 7.52,17.37 7.65,17.5 arc(8.02,18.05) 8.15,18.71 8.15,27.28 arc(8.05,27.81) 7.75,28.25 7.61,28.39 arc(7.49,28.47) 7.35,28.5 6.77,28.5 arc(6.38,28.58) v1(6.05,28.8)
  Inner2 w0.2: v1(6.05,28.8) 6.05,31.77 arc(6.19,32.49) 6.6,33.1 arc(7.04,33.4) 7.57,33.5 v1(10.8,33.5)
  Bottom Layer w0.2: U4.5 v1(10.8,33.5)
$1N3636: length 1.6
  Top Layer w0.2: PAD6.1 0.56,5 arc(0.69,4.97) 0.8,4.9 1.13,4.57 arc(1.24,4.5) RN1.2
$1N3640: length 1.4
  Top Layer w0.2: PAD8.1 0.58,3.5 arc(1,3.58) RN1.1
$1N3649: length 1.5
  Top Layer w0.2: PAD12.1 0.09,9.5 arc(0.78,9.36) RN3.2
$1N3653: length 1.4
  Top Layer w0.2: PAD14.1 0.58,8 arc(1,8.08) RN3.1
$1N3661: length 1.6
  Top Layer w0.2: PAD18.1 0.7,14 arc(0.79,13.98) 0.87,13.93 1.3,13.5 arc(1.33,13.48) RN5.2
$1N3665: length 1.4
  Top Layer w0.2: PAD20.1 0.58,12.5 arc(1,12.58) RN5.1
$1N8244: length 2.5
  Top Layer w0.2: U1.6 13.35,30.3 12.57,30.3 R3.1
$1N9187: length 1.3
  Top Layer w0.3: R20.2 19.08,31.54 arc(19.04,31.3) PWR1.2
$1N18898: length 2.9
  Inner2 w0.16: v1(5.05,13.7) 5.25,13.9 arc(5.64,14.16) 6.1,14.25 6.53,14.25 arc(7.12,14.37) v1(7.62,14.7)
$1N19006: length 8.9
  Top Layer w0.2: v1(4.68,14.7) C8.1
  Inner2 w0.16: v1(3.8,11.45) 1.96,11.45 arc(1.76,11.49) 1.6,11.6 arc(1.49,11.77) 1.45,11.96 1.45,13.03 arc(1.51,13.33) 1.68,13.58 1.91,13.81 arc(2.07,13.91) 2.25,13.95 3.87,13.95 arc(4.13,14) 4.35,14.15 4.53,14.33 arc(4.64,14.5) v1(4.68,14.7)
$1N21263: length 8.9
  Top Layer w0.2: v1(4.68,29.7) C9.1
  Inner2 w0.16: v1(3.8,26.45) 1.96,26.45 arc(1.76,26.49) 1.6,26.6 arc(1.49,26.77) 1.45,26.96 1.45,28.03 arc(1.51,28.33) 1.68,28.58 1.91,28.81 arc(2.07,28.91) 2.25,28.95 3.87,28.95 arc(4.13,29) 4.35,29.15 4.53,29.33 arc(4.64,29.5) v1(4.68,29.7)
